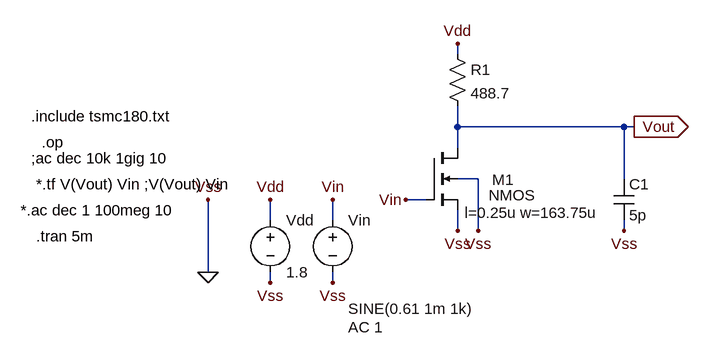
[diagram p0: schematic CS_amp_with_RModel.asc]
CS_amp_with_RModel.asc, the LTspice schematic file:
Version 4
SHEET 1 944 680
WIRE 432 -48 432 -64
WIRE 432 64 432 32
WIRE 688 64 432 64
WIRE 704 64 688 64
WIRE 432 96 432 64
WIRE 464 144 432 144
WIRE 688 144 688 64
WIRE 384 176 352 176
WIRE 144 208 144 176
WIRE 240 208 240 176
WIRE 432 224 432 192
WIRE 464 224 464 144
WIRE 688 224 688 208
WIRE 48 288 48 176
WIRE 144 304 144 288
WIRE 240 304 240 288
FLAG 48 288 0
FLAG 48 176 Vss
FLAG 240 176 Vin
FLAG 144 304 Vss
FLAG 240 304 Vss
FLAG 144 176 Vdd
FLAG 432 -64 Vdd
FLAG 352 176 Vin
FLAG 432 224 Vss
FLAG 464 224 Vss
FLAG 704 64 Vout
IOPIN 704 64 Out
FLAG 688 224 Vss
DATAFLAG 448 64 ""
SYMBOL nmos4 384 96 R0
WINDOW 0 101 49 Left 2
WINDOW 3 96 73 Left 2
WINDOW 123 59 100 Left 2
SYMATTR InstName M1
SYMATTR Value2 l=0.25u w=163.75u
SYMBOL voltage 144 192 R0
WINDOW 123 0 0 Left 0
WINDOW 39 0 0 Left 0
SYMATTR InstName Vdd
SYMATTR Value 1.8
SYMBOL voltage 240 192 R0
WINDOW 3 24 152 Left 2
WINDOW 123 24 180 Left 2
WINDOW 39 0 0 Left 0
SYMATTR Value SINE(0.61 1m 1k)
SYMATTR Value2 AC 1
SYMATTR InstName Vin
SYMBOL res 416 -64 R0
SYMATTR InstName R1
SYMATTR Value 488.7
SYMBOL cap 672 144 R0
SYMATTR InstName C1
SYMATTR Value 5p
TEXT -224 48 Left 2 !.include tsmc180.txt
TEXT -208 88 Left 2 !.op
TEXT -224 112 Left 2 !;ac dec 10k 1gig 10
TEXT -216 152 Left 2 !*.tf V(Vout) Vin ;V(Vout) Vin
TEXT -240 192 Left 2 !*.ac dec 1 100meg 10
TEXT -216 232 Left 2 !.tran 5m

The netlist it stands for:
* CS_amp_with_RModel.asc
M1 Vout Vin 0 0 NMOS l=0.25u w=163.75u
Vdd Vdd 0 1.8
Vin Vin 0 SINE(0.61 1m 1k) AC 1
R1 Vdd Vout 488.7
C1 Vout 0 5p
.model NMOS NMOS
.model PMOS PMOS
.lib standard.mos
.include tsmc180.txt
.op
;ac dec 10k 1gig 10
*.tf V(Vout) Vin ;V(Vout) Vin
*.ac dec 1 100meg 10
.tran 5m
.backanno
.end